# Altium schematic sheet ElectricalConductivityMeter.SchDoc
size A4
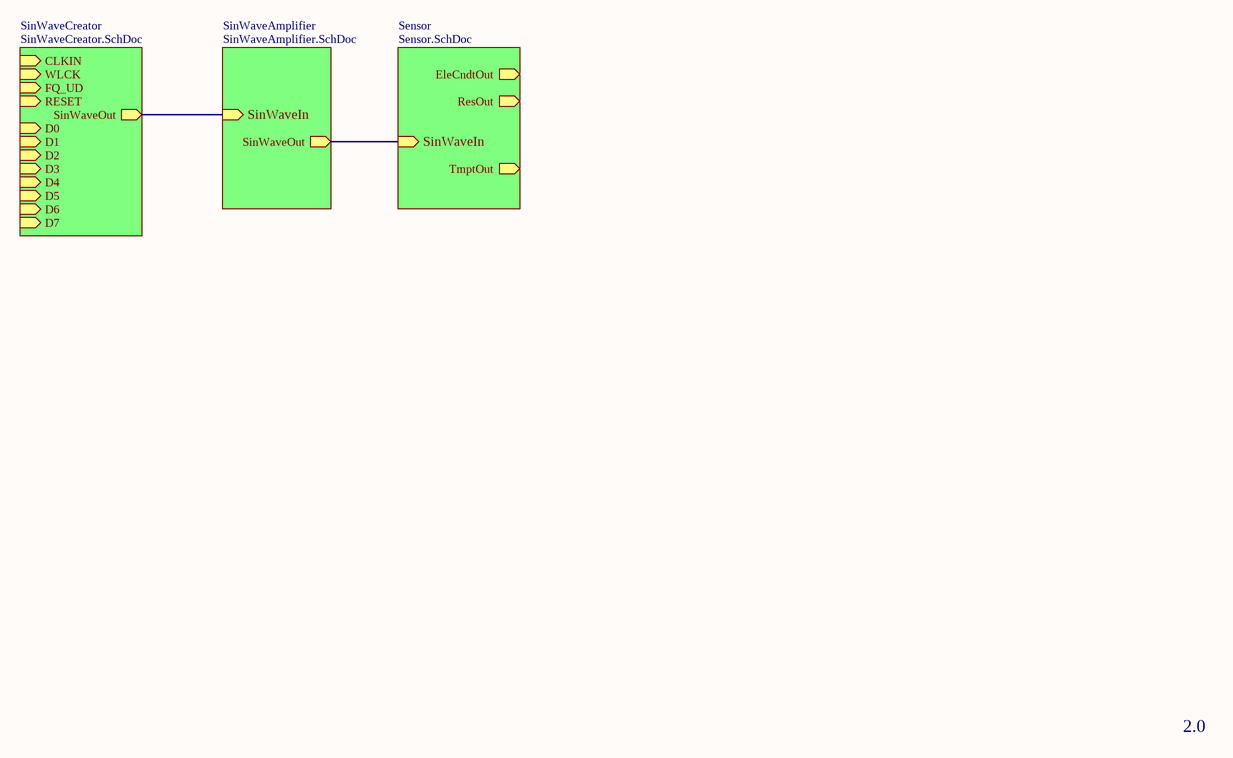
[diagram p0: ElectricalConductivityMeter.SchDoc]

## Sub-sheets
Sensor = Sensor.SchDoc: SinWaveIn (in), EleCndtOut (out), ResOut (out), TmptOut (out)
SinWaveAmplifier = SinWaveAmplifier.SchDoc: SinWaveIn (in), SinWaveOut (out)
SinWaveCreator = SinWaveCreator.SchDoc: SinWaveOut (out), D0 (in), D1 (in), D2 (in), D3 (in), D4 (in), D5 (in), D6 (in), D7 (in), CLKIN (in), WLCK (in), FQ_UD (in), RESET (in)

## Nets
(unnamed): sheet SinWaveCreator/SinWaveOut, sheet SinWaveAmplifier/SinWaveIn
(unnamed): sheet SinWaveAmplifier/SinWaveOut, sheet Sensor/SinWaveIn

## Notes on the sheet
- 2.0
- 图纸大小
- 文件名：
- A4
- 版本号
- 创建日期
- 单位
- 2019/11/28
- HFUT
- 修改日期
- 作者
- XuPeng